# EAGLE design Mini-Lora (EAGLE 6.5.0)
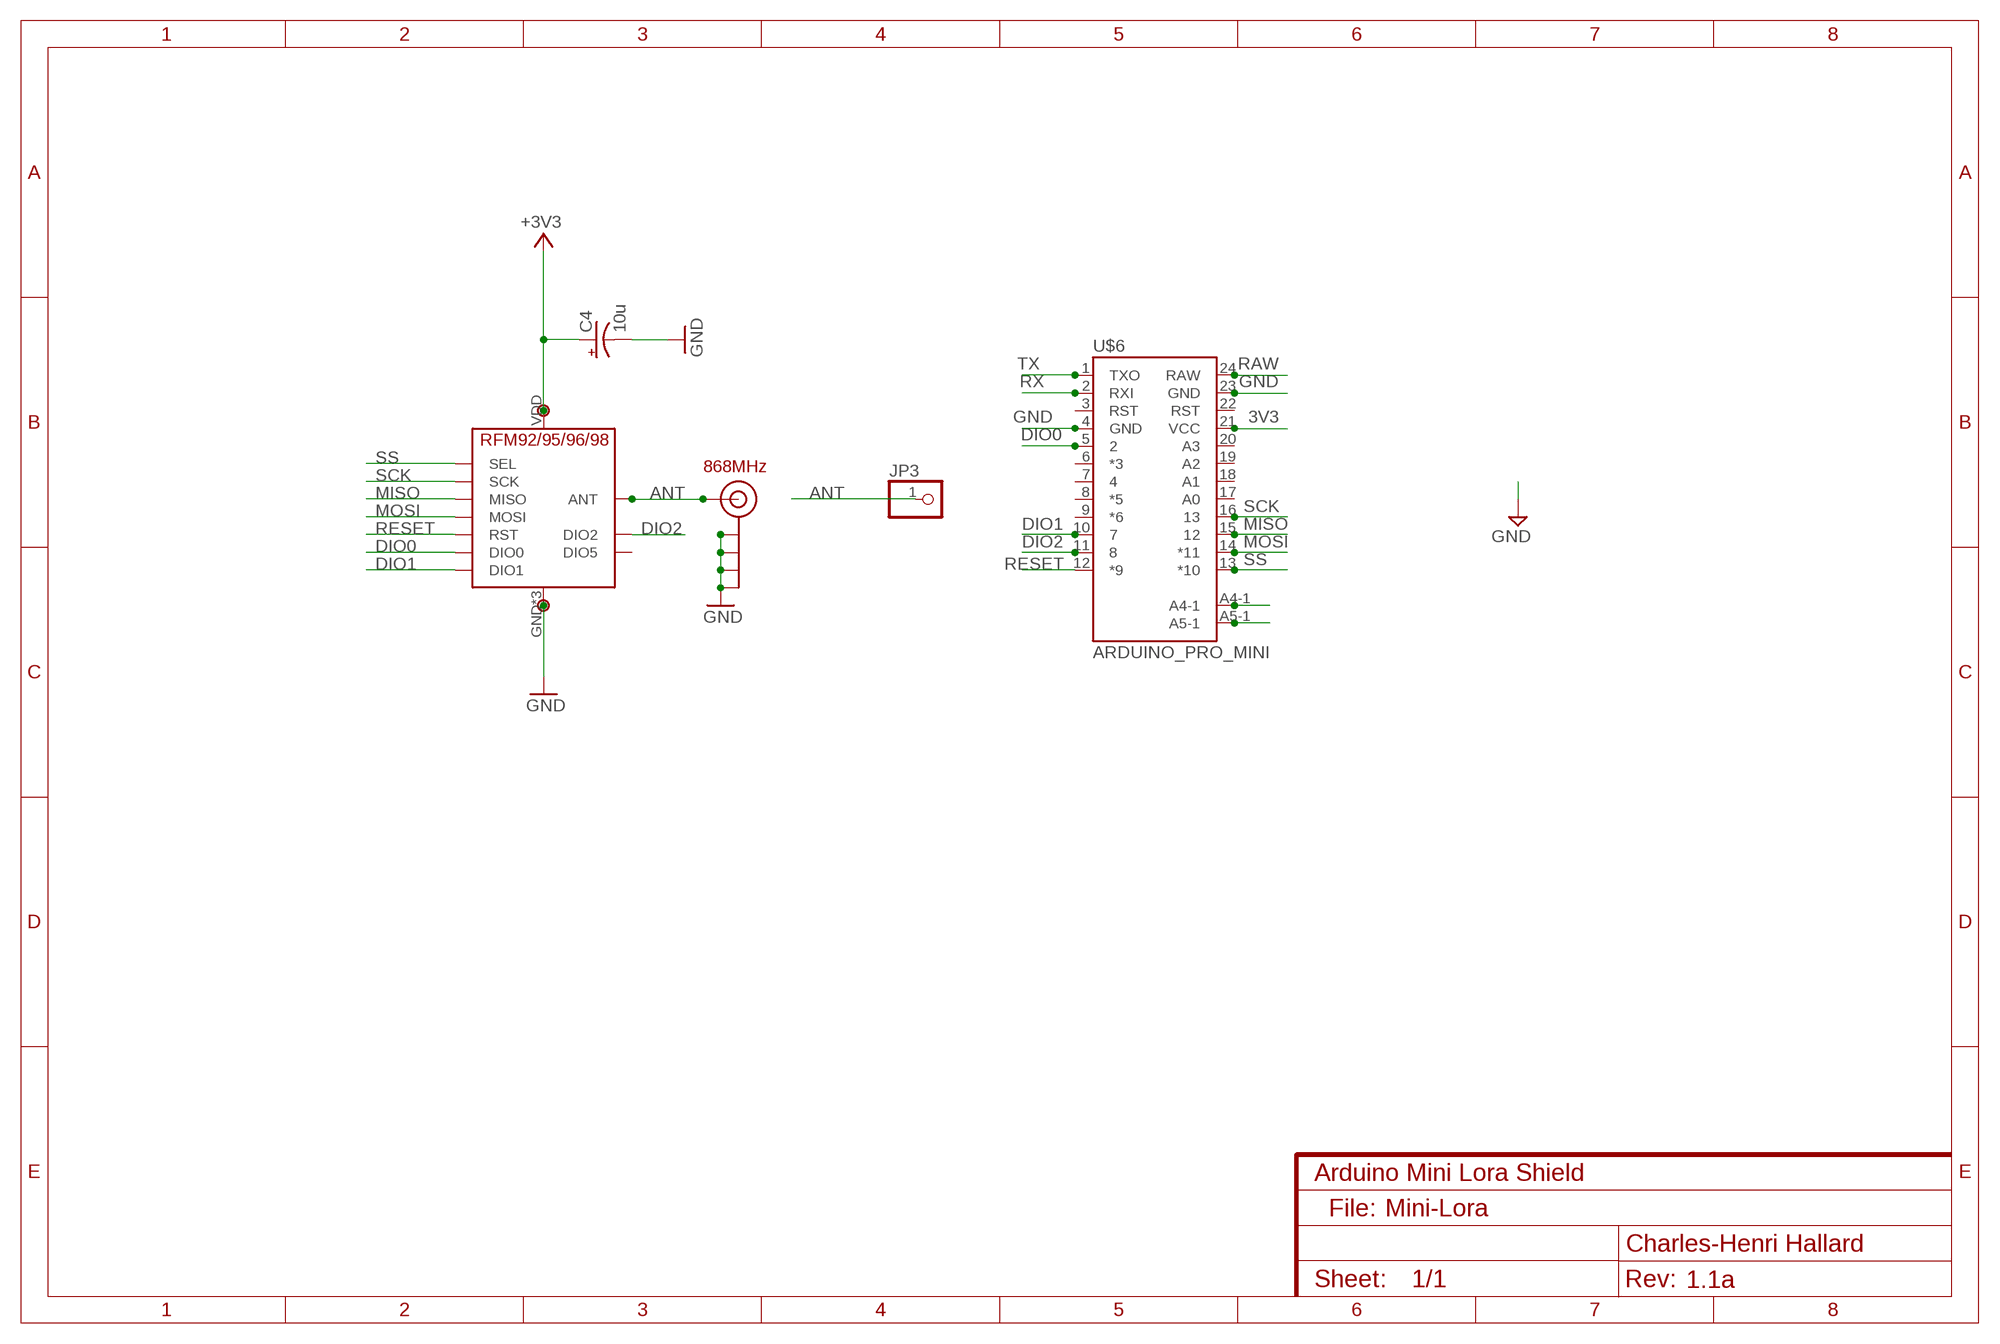
[diagram p0: schematic, sheet 1]
NAME (FRAME-A4L): CNAME: Arduino Mini Lora Shield; CREVISION: 1.1a; DESIGNER: Charles-Henri Hallard

## Parts
C4  10u  CAP_POLPTH2  [CPOL-RADIAL-10UF-25V]
J$2  ANTENNATINY  [SMA_UFL_PAD_TINY]
JP3  PINHD-1X1  [1X01]
P1  GND  PADNORMAL  [PAD]
P2  3v3  PADNORMAL  [PAD]
U$5  RFM95  [RFM95]
U$6  ARDUINO_PRO_MINI  [ARDUINO_PRO_MINI]

## Nets
3V3: C4.1(+) P2.1 U$5.VDD(VCC) U$6.21(VCC) ; supply symbol labelled +3V3
ANT: J$2.ANT1(SIGNAL) J$2.ANT2(SIGNAL) J$2.ANT3(SIGNAL) JP3.1 U$5.ANT
DIO0: U$5.DIO0 U$6.5
DIO1: U$5.DIO1 U$6.10
DIO2: U$5.DIO2 U$6.11
GND: C4.2(-) J$2.GND1(GND) J$2.GND2(GND) J$2.GND3(GND) J$2.GND4(GND) P1.1 U$5.GND U$5.GND1(GND) U$5.GND2(GND) U$6.4(GND) U$6.23(GND)
MISO: U$5.MISO U$6.15
MOSI: U$5.MOSI U$6.14(*11)
RAW: U$6.24(RAW)
RESET: U$5.RST U$6.12(*9)
RX: U$6.2(RXI)
SCK: U$5.SCK U$6.16
SCL: U$6.A5-1
SDA: U$6.A4-1
SS: U$5.NSS(SEL) U$6.13(*10)
TX: U$6.1(TXO)
Unconnected: U$5.DIO5 U$6.3(RST) U$6.6(*3) U$6.7 U$6.8(*5) U$6.9(*6) U$6.17(A0) U$6.18(A1) U$6.19(A2) U$6.20(A3) U$6.22(RST)

## Notes on the sheet
- 868MHz
- File:

## Library data of the parts
C4 = SparkFun-Passives:CAP_POL: Capacitor Polarized These are standard SMD and PTH capacitors. Normally 10uF, 47uF, and 100uF in electrolytic and tantalum varieties. Always verify the external diameter of the through hole cap, it varies with capacity, voltage, and manufacturer. The EIA devices should be standard.
J$2 = _c2h:ANTENNA: SMA Antenna Connector End launch SMA connector. The paste layer has been removed so that the connector can be hand soldered onto the board after reflow.
JP3 = pinhead:PINHD-1X1: PIN HEADER
P1 P2 = _c2h:PAD
U$5 = _c2h:RFM95
U$6 = _c2h:ARDUINO_PRO_MINI

## Net classes
0 default: width 0.406 mm, drill 0.356 mm, clearance 0.406 mm
1 power: width 0.203 mm, clearance 0.152 mm
2 GND: width 0.203 mm, drill 0.305 mm, clearance 0.152 mm

## Board
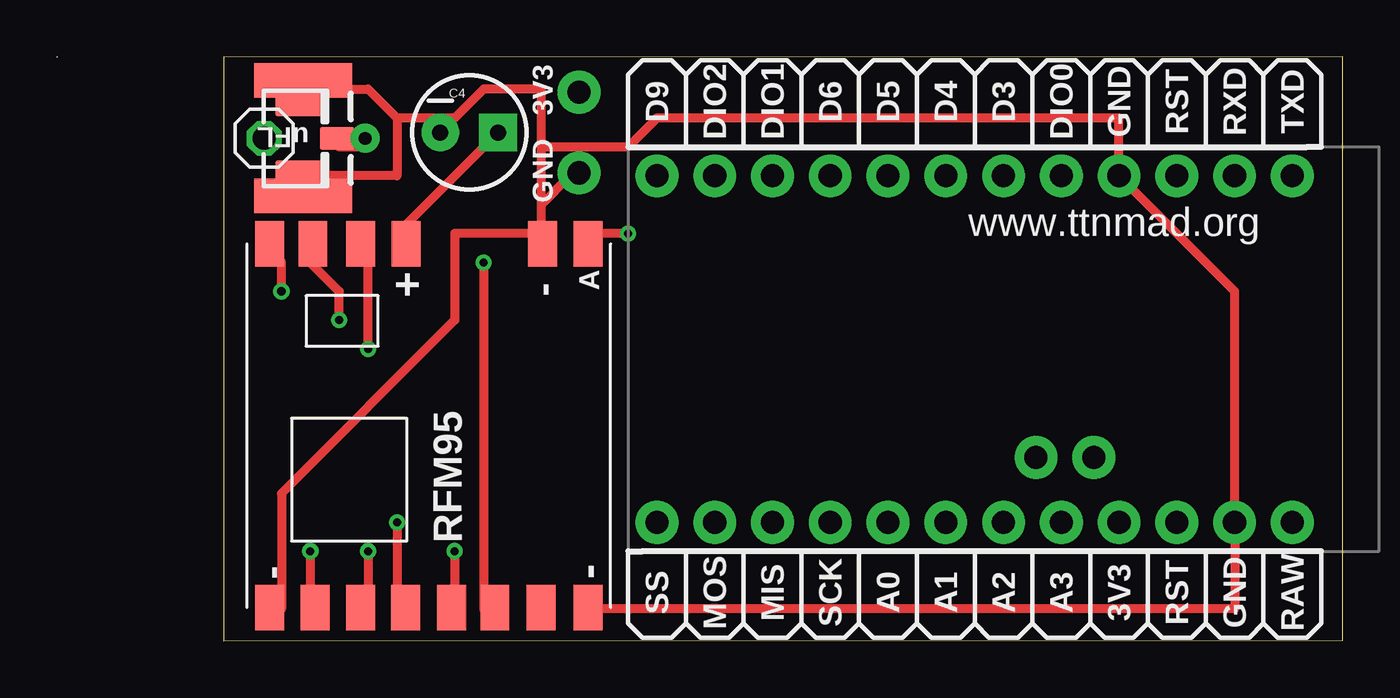
[diagram p1: board, top side]
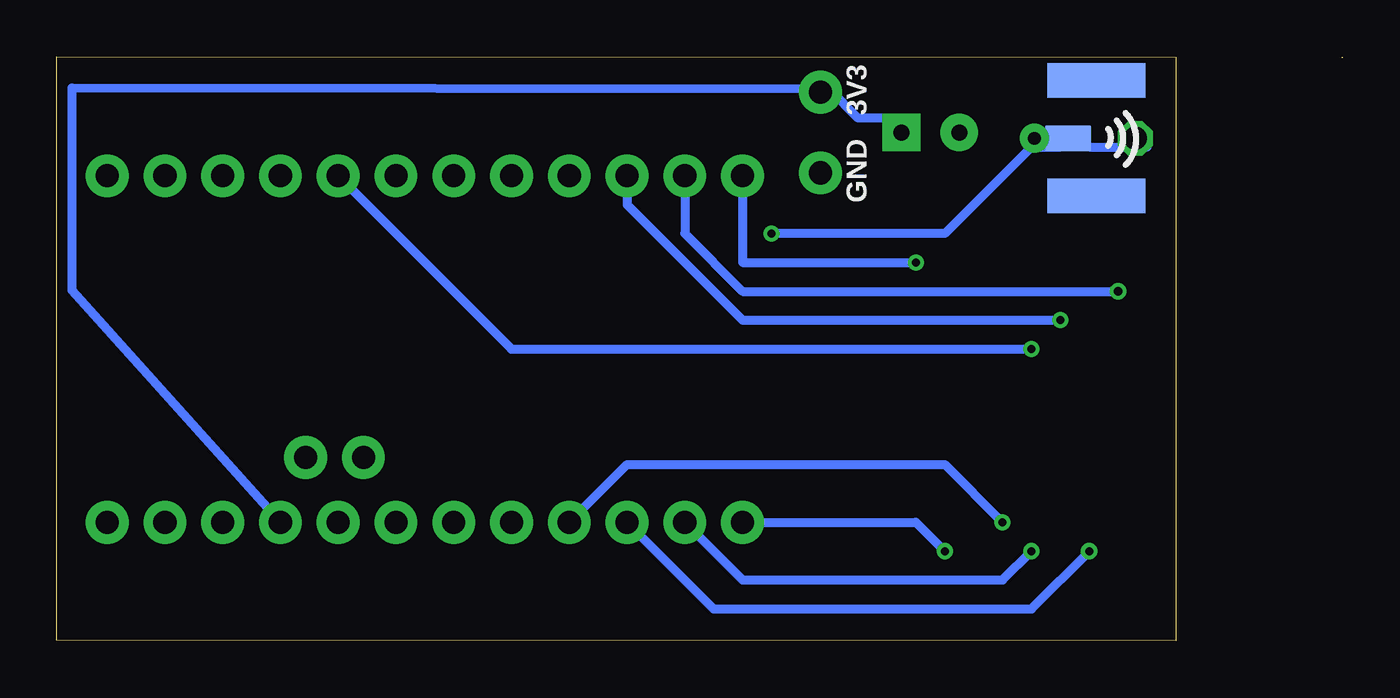
[diagram p2: board, bottom side, seen from below]

Size 56.53 x 25.68 mm. Coordinates in mm from the lower left corner, seen from the top.
Outline: 0.03,25.65 0,25.65
Outline: 56.53,25.68 7.33,25.65 7.33,0 56.53,0.03 56.53,25.68
Copper layers (1*16): Top 0.0356mm / dielectric 1.5011mm / Bottom 0.0356mm
Design rules "PCBs_io": minimum track width 6mil, minimum drill 13mil, track to track 6mil, track to pad 6mil, pad to pad 6mil, via to via 6mil, smd to smd 6mil, copper to edge 15mil, drill to drill 6mil, minimum pad ring 7mil, minimum via ring 7mil, stop-mask expansion 3mil, vias tented up to drill 40mil, thermal gap 10mil

### Footprints (pad centres in the part's own frame; a part is rotated, then mirrored left to right if it is on the bottom)
CPOL-RADIAL-10UF-25V = drill 0.7 pad 1.651 square: 1 1.27,0 | drill 0.7 pad 1.651: 2 -1.27,0
SMA_UFL_PAD_TINY = smd 1.524 x 1.016: ANT1 -3.843,0 | drill 0.559 pad 1.27: ANT2 -5.08,0 | smd 2.032 x 1.143 bottom: ANT3 -3.589,0 | smd 2.2 x 1.016: GND1 -2.223,1.47; GND2 -2.223,-1.47 | smd 4.318 x 1.524: GND3 -2.349,-2.54; GND4 -2.349,2.54 | smd 4.318 x 1.524 bottom: GND5 -2.349,2.54; GND6 -2.349,-2.54
1X01 = drill 1.016 octagon: 1 0,0
PAD = drill 1.016 pad 1.88: 1 0,0
RFM95 = smd 2 x 1.27: ANT 5.777,-7; DIO0 5.777,3; DIO1 5.779,5.095; DIO2 5.779,7; DIO5 -10.225,-4.936; GND 5.777,-5; GND1 -10.223,7; GND2 -10.23,-7; MISO -10.23,5; MOSI -10.225,3; NSS -10.223,-1; RST -10.223,-2.905; SCK -10.23,1.012; VDD 5.777,1
ARDUINO_PRO_MINI = drill 1.016 pad 1.88: 1 -7.62,12.7; 2 -7.62,10.16; 3 -7.62,7.62; 4 -7.62,5.08; 5 -7.62,2.54; 6 -7.62,0; 7 -7.62,-2.54; 8 -7.62,-5.08; 9 -7.62,-7.62; 10 -7.62,-10.16; 11 -7.62,-12.7; 12 -7.62,-15.24; 13 7.62,-15.24; 14 7.62,-12.7; 15 7.62,-10.16; 16 7.62,-7.62; 17 7.62,-5.08; 18 7.62,-2.54; 19 7.62,0; 20 7.62,2.54; 21 7.62,5.08; 22 7.62,7.62; 23 7.62,10.16; 24 7.62,12.7; A4-1 4.763,1.429; A5-1 4.763,3.969

### Placement (x,y rotation side)
C4  18.13,22.35 0 top
J$2  8.48,22.1 180 top
JP3  9.11,22.1 0 top
P1  22.96,20.57 0 top
P2  22.96,24.13 0 top
U$5  16.35,11.68 90 top
U$6  41.62,12.83 270 top

### Tracks (layer width: path | path; a pad name or v marks a point on that pad's centre or on a via)
3V3
  Top 0.406: U$5.VDD 14.95,17.91 18.76,21.72 C4.1
  Bottom 0.406: C4.1 20.03,22.99 21.3,22.99 22.57,24.26 P2.1 23.84,24.26 55.87,24.31 55.87,15.42 U$6.21
ANT  (via drill 0.36)
  Top 0.406: J$2.ANT1 12.41,21.72 13.68,21.72 J$2.ANT2 | v25.11,17.91 23.84,17.91 U$5.ANT
  Bottom 0.406: v25.11,17.91 17.49,17.91 13.68,21.72 | 13.68,21.72 J$2.ANT2 13.68,21.72 | 13.68,21.72 12.41,21.72 J$2.ANT3 11.14,21.72 8.6,21.72 JP3.1
DIO0  (via drill 0.36)
  Top 0.406: v13.68,12.83 13.68,16.64 U$5.DIO0
  Bottom 0.406: v13.68,12.83 36.54,12.83 U$6.5
DIO1  (via drill 0.36)
  Top 0.406: v12.41,14.1 12.41,15.37 11.14,16.64 U$5.DIO1
  Bottom 0.406: v12.41,14.1 26.38,14.1 31.46,19.18 U$6.10
DIO2  (via drill 0.36)
  Top 0.406: v9.87,15.37 9.87,16.64 U$5.DIO2
  Bottom 0.406: v9.87,15.37 26.38,15.37 28.92,17.91 U$6.11
GND
  Top 0.406: 11.14,20.45 11.14,19.18 J$2.GND4 | 11.14,20.45 J$2.GND1 11.14,20.45 | 11.14,20.45 14.95,20.45 14.95,22.99 | 14.95,22.99 13.68,24.26 11.14,24.26 J$2.GND3 10.83,23.57 J$2.GND2 | 21.3,17.91 17.49,17.91 17.49,14.1 9.87,6.48 9.87,1.4 U$5.GND1 | 21.3,17.91 U$5.GND 21.3,17.91 | 21.3,19.18 22.57,20.45 P1.1 | 21.3,17.91 21.3,19.18 | 16.86,22.99 17.49,22.99 18.76,24.26 21.3,24.26 21.3,21.72 | 16.86,22.99 14.95,22.99 | 21.3,19.18 21.3,21.72 | U$5.GND2 23.84,1.4 51.78,1.4 U$6.23 51.78,15.37 U$6.4 46.7,22.99 26.38,22.99 25.11,21.72 21.3,21.72 | C4.2 16.86,22.99
MISO  (via drill 0.36)
  Top 0.406: v11.14,3.94 11.14,1.4 U$5.MISO
  Bottom 0.406: v11.14,3.94 13.68,1.4 27.65,1.4 U$6.15
MOSI  (via drill 0.36)
  Top 0.406: v13.68,3.94 13.68,1.4 U$5.MOSI
  Bottom 0.406: v13.68,3.94 14.95,2.67 26.38,2.67 U$6.14
RESET  (via drill 0.36)
  Top 0.406: v18.76,16.64 18.76,1.4 U$5.RST
  Bottom 0.406: v18.76,16.64 26.38,16.64 U$6.12
SCK  (via drill 0.36)
  Top 0.406: v14.95,5.21 14.95,1.4 U$5.SCK
  Bottom 0.406: v14.95,5.21 17.49,7.75 31.46,7.75 U$6.16
SS  (via drill 0.36)
  Top 0.406: v17.49,3.94 17.49,1.4 U$5.NSS
  Bottom 0.406: v17.49,3.94 18.76,5.21 U$6.13

### Text on the board
tPlace: www.ttnmad.org
tNames: 3V3 | D9 | DIO2 | DIO1 | D6 | D5 | D4 | D3 | DIO0 | GND | RST | RXD | TXD | GND | RFM95 | SS | MOS | MIS | SCK | A0 | A1 | A2 | A3 | 3V3 | RST | GND | RAW
bNames: 3V3 | GND
200bmp: www.ttnmad.org